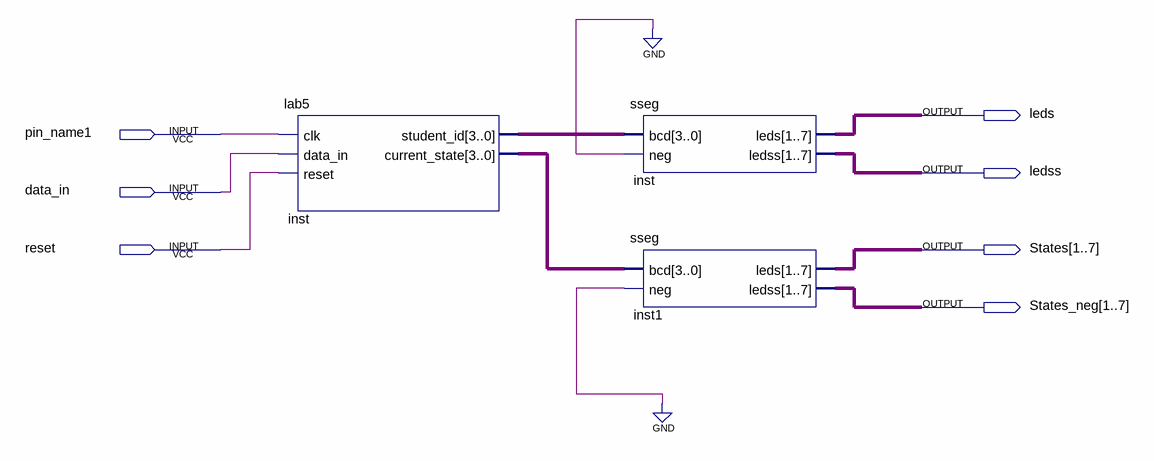
[diagram p0: schematic sheet]
// Quartus schematic FSM.bdf as structural Verilog: 3 symbols, 7 pins
module FSM (
  input  pin_name1,
  input  data_in,
  input  reset,
  output leds,
  output ledss,
  output [1:7] States,
  output [1:7] States_neg
);

  wire [3:0] inst_current_state, inst_student_id;
  wire [6:0] inst_leds, inst_ledss;

  lab5 inst (
    .clk(pin_name1), .data_in(data_in), .reset(reset), .student_id(inst_student_id),
    .current_state(inst_current_state));
  sseg inst_dup2 (.bcd(inst_student_id), .neg(1'b0), .leds(inst_leds), .ledss(inst_ledss));
  sseg inst1 (.bcd(inst_current_state), .neg(1'b0), .leds(States), .ledss(States_neg));
endmodule
